# EAGLE design fabflash-mk-2.1-booster (EAGLE 6.5.0)
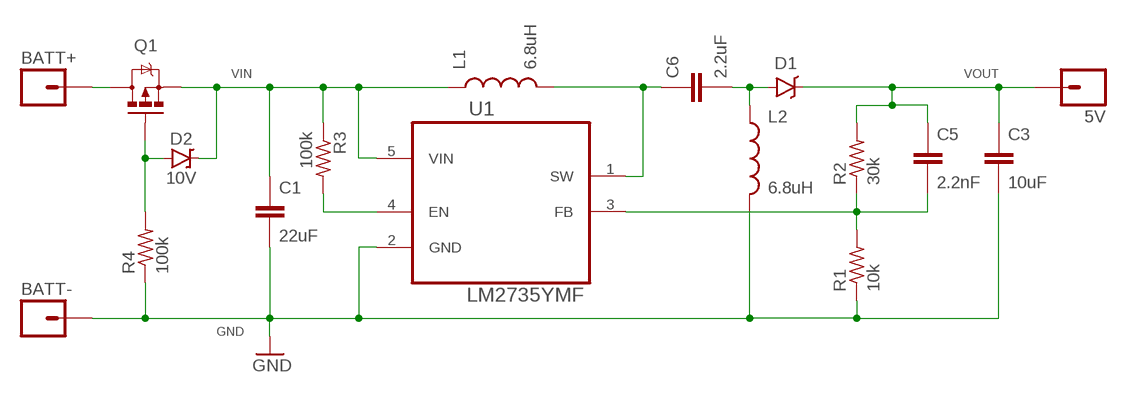
[diagram p0: schematic, sheet 1]

## Parts
5V  M01PTH-1.2MM  [1X01-1.2MM]
BATT+  M01NOT-A-VIA-NOPE  [1X01_NOSILK_NOSTOP]
BATT-  M01NOT-A-VIA-NOPE  [1X01_NOSILK_NOSTOP]
C1  22uF  CAPACITOR-CERAMICC0805  [C0805]
C3  10uF  CAPACITOR-CERAMICC0805  [C0805]
C5  2.2nF  CAPACITOR-CERAMICC0805  [C0805]
C6  2.2uF  CAPACITOR-CERAMICC0805  [C0805]
D1  B340A  DIODE-SCHOTTKYB340A  [SMA-DIODE]
D2  10V  DIODE-ZENERSOD123  [SOD123]
L1  6.8uH  INDUCTORTAIYO-YUDEN-40XX  [TAIYO-YUDEN-40XX]
L2  6.8uH  INDUCTORTAIYO-YUDEN-40XX  [TAIYO-YUDEN-40XX]
Q1  MOSFET-PCHANNELIRLML2244  [SOT23-3]
R1  10k  RESISTORR0805  [R0805]
R2  30k  RESISTORR0805  [R0805]
R3  100k  RESISTORR0603  [R0603]
R4  100k  RESISTORR0603  [R0603]
U1  LM2735YMF  [SOT95P285X110-5N]

## Nets
BATT+: BATT+.P$1 Q1.3(D)
GND: BATT-.P$1 C1.2 C3.2 L2.2 R1.1 R4.1 U1.2(GND)
N$1: C6.1 L1.2 U1.1(SW)
N$2: R3.2 U1.4(EN)
N$4: D2.A Q1.1(G) R4.2
N$6: C6.2 D1.A L2.1
N$8: C5.2 R1.2 R2.1 U1.3(FB)
VIN: C1.1 D2.C L1.1 Q1.2(S) R3.1 U1.5(VIN)
VOUT: 5V.P$1 C3.1 C5.1 D1.C R2.2

## Library data of the parts
5V BATT+ BATT- = A_butts:M01: Header 1 Standard 1-pin 0.1" header. Use with straight break away headers (SKU : PRT-00116), right angle break away headers (PRT-00553), swiss pins (PRT-00743), machine pins (PRT-00117), and female headers (PRT-00115).
C1 C3 C5 C6 = A_butts:CAPACITOR-CERAMIC: CAPACITOR, European symbol
D1 = A_butts:DIODE-SCHOTTKY: Schottky diodes in SFE's production catalog BAT20J 1A 23V 0.62Vf RB751 120mA 40V 0.37Vf PMEG4005EJ 0.5A 40V 0.42Vf MBRA140 1A 40V 0.5Vf B340A 3A 40V SMA; PROD_ID: DIO-09886
D2 = A_butts:DIODE-ZENER: Zener Diode Production Part - 8199 3.4V Zener Voltage
L1 L2 = A_butts:INDUCTOR: Inductors Basic Inductor/Choke - 0603 and 1206. Footprints are not proven and vary greatly between part numbers. SRN6045- 33uH, 20% 1.4A SDR0403-560KL - 56uH, 10%, 500mA RMS/740mA peak
Q1 = A_butts:MOSFET-PCHANNEL: Generic PMOSFET IRLML2244 - TRANS-11153 (SOT-23 -20V -4.3A) (1.Gate 2.Source 3.Drain) FQP27P06 - COM-10349 <http://www.sparkfun.com/products/10349> (TO-220 -60V -27A) (1.Gate 2.Source 3.Drain); PROD_ID: TRANS-11153
R1-R4 = A_butts:RESISTOR: RESISTOR, American symbol
U1 = A_butts:LM2735YMF: IC BOOST SEPIC ADJ 2.1A; MPN: LM2735YMF; OC_FARNELL: 1426509; OC_NEWARK: 50M8801; PACKAGE: SOT23-5; SUPPLIER: National Semiconductor

## Board
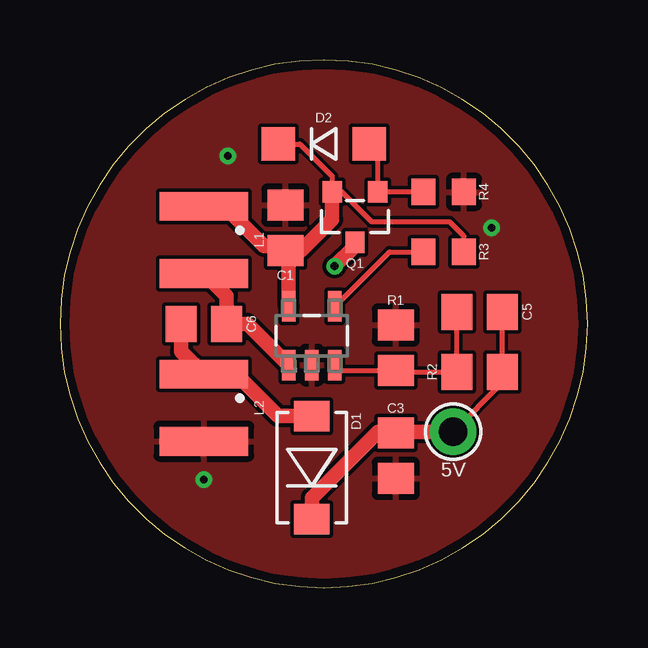
[diagram p1: board, top side]
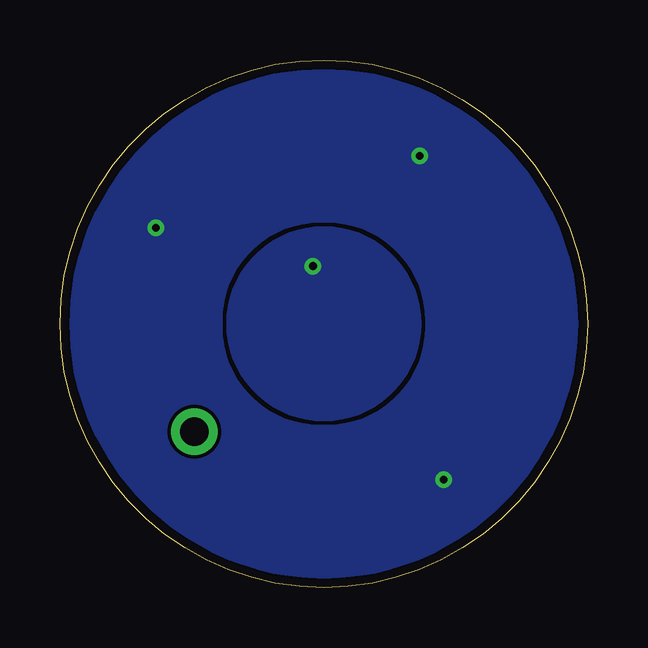
[diagram p2: board, bottom side, seen from below]

Size 22 x 22 mm. Coordinates in mm from the lower left corner, seen from the top.
Outline: 0,11 arc90 11,0 arc90 22,11 arc90 11,22 arc90 0,11
Copper layers (1*16): Top 0.0356mm / dielectric 1.5011mm / Bottom 0.0356mm
Design rules "LaenPCBOrder2": minimum track width 6mil, minimum drill 13mil, track to track 6mil, track to pad 6mil, pad to pad 6mil, via to via 6mil, smd to smd 6mil, copper to edge 15mil, drill to drill 6mil, minimum pad ring 7mil, minimum via ring 7mil, stop-mask expansion 3mil, vias tented up to drill 20mil, thermal gap 10mil

### Footprints (pad centres in the part's own frame; a part is rotated, then mirrored left to right if it is on the bottom)
1X01-1.2MM = drill 1.2 pad 1.93: P$1 0,0
1X01_NOSILK_NOSTOP = drill 0.33: P$1 0,0
C0805 = smd 1.3 x 1.5: 1 -0.95,0; 2 0.95,0
SMA-DIODE = smd 1.27 x 1.47: A -2.15,0; C 2.15,0
SOD123 = smd 1.4 x 1.4: A 1.9,0; C -1.9,0
TAIYO-YUDEN-40XX = smd 1.2 x 3.7: 1 -1.4,0; 2 1.4,0
SOT23-3 = smd 0.8 x 0.9: 1 -0.95,-1; 2 0.95,-1; 3 0,1.1
R0805 = smd 1.3 x 1.5: 1 -0.95,0; 2 0.95,0
R0603 = smd 1 x 1.1: 1 -0.85,0; 2 0.85,0
SOT95P285X110-5N = smd 1.27 x 0.559: 1 -1.219,0.965; 2 -1.219,0; 3 -1.219,-0.965; 4 1.219,-0.965; 5 1.219,0.965

### Placement (x,y rotation side)
5V  16.4,6.5 180 top
BATT+  11.45,13.4 0 top
BATT-  18,15 0 top
C1  9.4,15 90 top
C3  14,5.5 270 top
C5  17.5,11.5 180 top
C6  6,11 180 top
D1  10.5,5 270 top
D2  11,18.5 0 top
L1  6,14.5 270 top
L2  6,7.5 270 top
Q1  12.3,15.5 180 top
R1  14,10 270 top
R2  17.5,9 0 top
R3  16,14 180 top
R4  16,16.5 180 top
U1  10.5,10.5 90 top

### Tracks (layer width: path | path; a pad name or v marks a point on that pad's centre or on a via)
BATT+
  Top 0.61: BATT+.P$1 12.3,14.25 Q1.3
  pour Bottom: 11,7 arc-90 7,11 arc-90 11,15 arc-90 15,11 arc-90
GND  (via drill 0.33)
  other vias: 7,18 6,4.5
  pour Top (rank 6): 11,0 arc-90 0,11 arc-90 11,22 arc-90 22,11 arc-90
  pour Bottom (rank 6): 11,0 arc-90 0,11 arc-90 11,22 arc-90 22,11 arc-90
N$1
  Top 0.61: L1.2 6.95,12.15 C6.1 7.82,11 U1.1
N$2
  Top 0.2: U1.4 13.75,14 R3.2
N$4
  Top 0.2: R4.2 Q1.1 13.25,18.15 D2.A
N$6
  Top 0.61: C6.2 5.05,9.85 L2.1 6.15,8.75 7.5,8.75 9.1,7.15 D1.A
N$8
  Top 0.2: U1.3 11.7,9.05 R1.2 14.05,9 R2.1 C5.2
VIN
  Top 0.2: D2.C 10,18.5 11.35,17.15 Q1.2 11.75,16.5 13,15.25 16.25,15.25 16.85,14.65 R3.1
  Top 0.61: C1.1 10.05,14.05 11.35,15.35 Q1.2 | C1.1 9.2,14.25 8.5,14.25 6.85,15.9 L1.1 | U1.5 9.54,13.91 C1.1
VOUT
  Top 0.2: 5V.P$1 18.45,8.55 R2.2 C5.1
  Top 0.61: D1.C 10.5,3.75 13.25,6.5 13.95,6.5 C3.1 14.05,6.5 5V.P$1